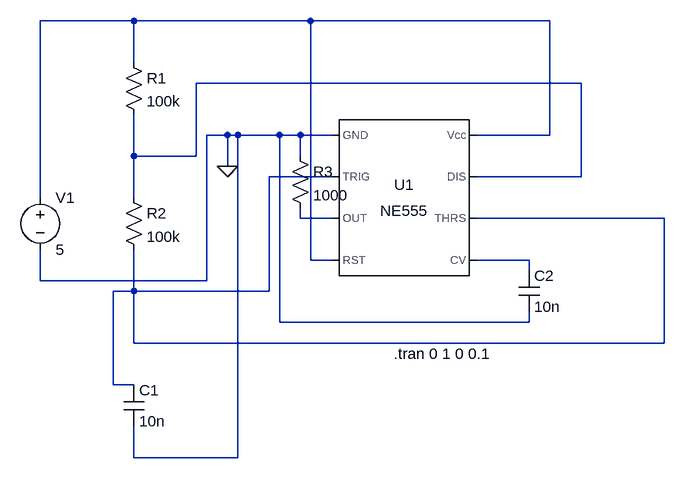
[diagram p0: schematic ne555astable.asc]
ne555astable.asc, the LTspice schematic file:
Version 4
SHEET 1 880 740
WIRE -832 64 -976 64
WIRE -560 64 -832 64
WIRE -192 64 -560 64
WIRE -832 128 -832 64
WIRE -144 160 -736 160
WIRE -688 240 -720 240
WIRE -672 240 -688 240
WIRE -608 240 -672 240
WIRE -576 240 -608 240
WIRE -528 240 -576 240
WIRE -192 240 -192 64
WIRE -192 240 -304 240
WIRE -832 272 -832 208
WIRE -736 272 -736 160
WIRE -736 272 -832 272
WIRE -576 272 -576 240
WIRE -688 288 -688 240
WIRE -528 304 -624 304
WIRE -144 304 -144 160
WIRE -144 304 -304 304
WIRE -976 336 -976 64
WIRE -832 336 -832 272
WIRE -576 368 -576 352
WIRE -528 368 -576 368
WIRE -16 368 -304 368
WIRE -560 432 -560 64
WIRE -528 432 -560 432
WIRE -224 432 -304 432
WIRE -224 448 -224 432
WIRE -976 464 -976 416
WIRE -720 464 -720 240
WIRE -720 464 -976 464
WIRE -832 480 -832 416
WIRE -832 480 -864 480
WIRE -624 480 -624 304
WIRE -624 480 -832 480
WIRE -608 528 -608 240
WIRE -224 528 -224 512
WIRE -224 528 -608 528
WIRE -832 560 -832 480
WIRE -16 560 -16 368
WIRE -16 560 -832 560
WIRE -864 624 -864 480
WIRE -832 624 -864 624
WIRE -832 736 -832 688
WIRE -672 736 -672 240
WIRE -672 736 -832 736
FLAG -688 288 0
SYMBOL Misc/NE555 -416 336 R0
SYMATTR InstName U1
SYMBOL res -848 112 R0
SYMATTR InstName R1
SYMATTR Value 100k
SYMBOL res -848 320 R0
SYMATTR InstName R2
SYMATTR Value 100k
SYMBOL cap -848 624 R0
SYMATTR InstName C1
SYMATTR Value 10n
SYMBOL cap -240 448 R0
SYMATTR InstName C2
SYMATTR Value 10n
SYMBOL voltage -976 320 R0
SYMATTR InstName V1
SYMATTR Value 5
SYMBOL res -592 256 R0
SYMATTR InstName R3
SYMATTR Value 1000
TEXT -432 576 Left 2 !.tran 0 1 0 0.1

The netlist it stands for:
* ne555astable.asc
XU1 0 N003 N004 N001 N005 N003 N002 N001 NE555  ; pins GND TRIG OUT RST CV THRS DIS Vcc
R1 N001 N002 100k
R2 N002 N003 100k
C1 N003 0 10n
C2 N005 0 10n
V1 N001 0 5
R3 0 N004 1000
.tran 0 1 0 0.1
.lib NE555.sub
.backanno
.end